# EAGLE design PCB PUMP (EAGLE 9.3.1)
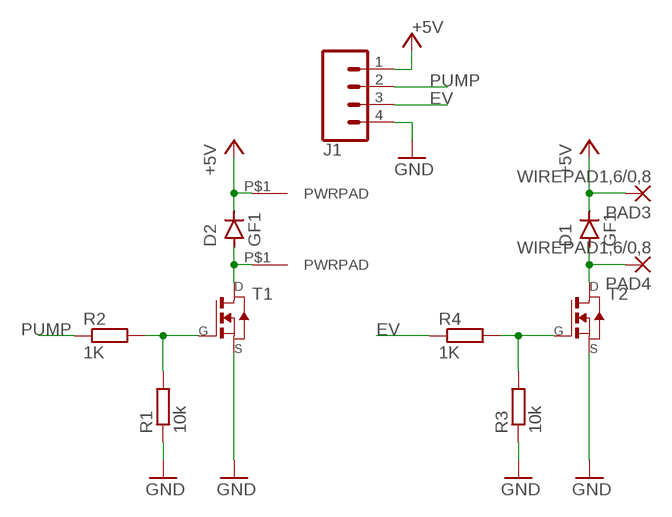
[diagram p0: schematic, sheet 1]

## Parts
D1  GF1  [SMA-DO214AC]
D2  GF1  [SMA-DO214AC]
J1  CONN_04POLAR  [MOLEX-1X4]
J3  PWRPAD2-5MM  [PWRPAD_2-5MM]
J4  PWRPAD2-5MM  [PWRPAD_2-5MM]
PAD3  WIREPAD1,6/0,8  [1,6/0,8]
PAD4  WIREPAD1,6/0,8  [1,6/0,8]
R1  10k  R-EU_R1206  [R1206]
R2  1K  R-EU_R1206  [R1206]
R3  10k  R-EU_R1206  [R1206]
R4  1K  R-EU_R1206  [R1206]
T1  NMOSFETSOT23  [SOT-23]
T2  NMOSFETSOT23  [SOT-23]

## Nets
+5V: D1.K(C) D2.K(C) J1.1 J4.P$1(PWRPAD) PAD3.1(P)
EV: J1.3 R4.1
GND: J1.4 R1.1 R3.1 T1.2(S) T2.2(S)
N$1: D1.A PAD4.1(P) T2.1(D)
N$2: D2.A J3.P$1(PWRPAD) T1.1(D)
N$3: R1.2 R2.2 T1.3(G)
N$4: R3.2 R4.2 T2.3(G)
PUMP: J1.2 R2.1

## Library data of the parts
D1 D2 = diode:GF1: DIODE
J1 = CONNECTORS:CONN_04: Multi connection point. Often used as Generic Header-pin footprint for 0.1 inch spaced/style header connections On any of the 0.1 inch spaced packages, you can populate with these: Break Away Headers - Straight <https://www.sparkfun.com/products/116> (PRT-00116) Break Away Male Headers - Right Angle <https://www.sparkfun.com/products/553> (PRT-00553) Female Headers <https://www.sparkfun.com/products/115> (PRT-00115) Break Away Headers - Machine Pin <https://www.sparkfun.com/products/117> (PRT-00117) Break Away Female Headers - Swiss Machine Pin <https://www.sparkfun.com/products/743> (PRT-00743) For SCREWTERMINALS and SPRING TERMINALS visit here: Screw Terimnals on SparkFun.com <https://www.sparkfun.com/search/results?term=Screw+Terminals> (5mm/3.5mm/2.54mm spacing) This device is also useful as a general connection point to wire up your design to another part of your project. Our various solder wires solder well into these plated through hole pads. Hook-Up Wire - Assortment (Stranded, 22 AWG) <https://www.sparkfun.com/products/11375> (PRT-11375) Hook-Up Wire - Assortment (Solid Core, 22 AWG) <https://www.sparkfun.com/products/11367> (PRT-11367) View the entire wire category on our website here <https://www.sparkfun.com/categories/141> Special notes: Molex polarized connector foot print use with SKU : PRT-08231 with associated crimp pins and housings. 1MM SMD Version SKU: PRT-10208; PROD_ID: CONN-08186; SF_ID: PRT-08231
J3 J4 = fab:PWRPAD
PAD3 PAD4 = wirepad:WIREPAD: Wire PAD connect wire on PCB
R1-R4 = rcl:R-EU_: RESISTOR, European symbol; SPICEPREFIX: R
T1 T2 = fab:NMOSFET: MOS FET

## Board
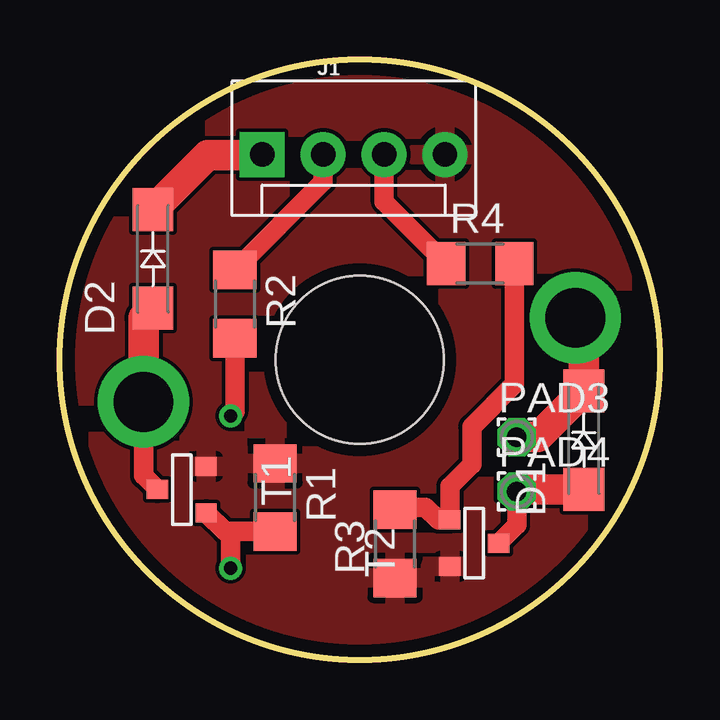
[diagram p1: board, top side]
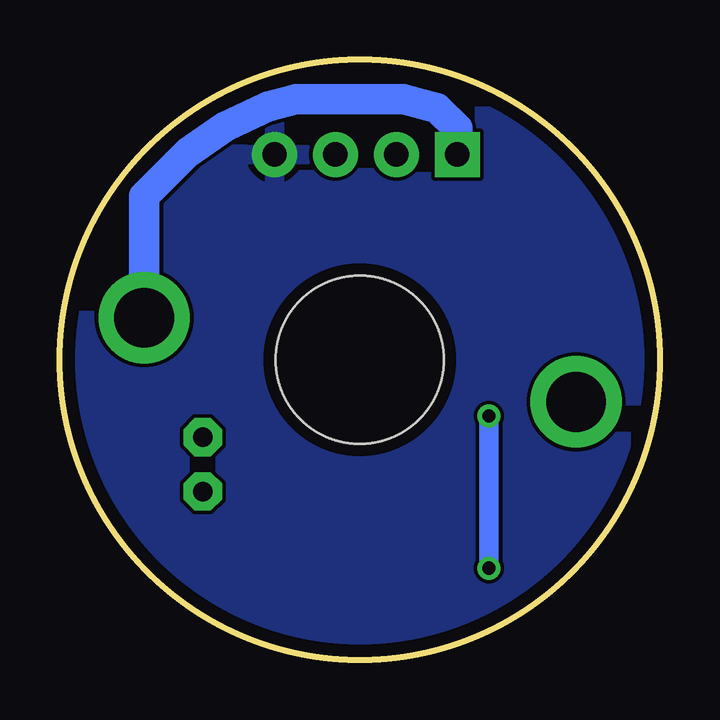
[diagram p2: board, bottom side, seen from below]

Size 25 x 25 mm. Coordinates in mm from the lower left corner, seen from the top.
Outline: circle at 12.5,12.5 radius 12.5
Copper layers (1*16): Top 0.035mm / dielectric 1.5mm / Bottom 0.035mm
Design rules "default *": minimum track width 6mil, minimum drill 0.35mm, track to track 6mil, track to pad 6mil, pad to pad 6mil, via to via 6mil, smd to smd 6mil, copper to edge 20mil, drill to drill 6mil, minimum pad ring 10mil, minimum via ring 8mil, stop-mask expansion 4mil, vias tented up to drill 0mil, thermal gap 10mil
Holes 7 mm at 12.5,12.5

### Footprints (pad centres in the part's own frame; a part is rotated, then mirrored left to right if it is on the bottom)
SMA-DO214AC = smd 1.8 x 1.7: A -2.05,0; K 2.05,0
MOLEX-1X4 = drill 1.016 pad 1.88 square: 1 0,0 | drill 1.016 pad 1.88: 2 2.54,0; 3 5.08,0; 4 7.62,0
PWRPAD_2-5MM = drill 2.489 pad 3.81: P$1 0,0
1,6/0,8 = drill 0.813 pad 1.6 octagon: 1 0,0
R1206 = smd 1.6 x 1.803: 1 -1.422,0; 2 1.422,0
SOT-23 = smd 0.787 x 0.889: 1 0.025,-1.016; 2 -0.94,1.016; 3 0.991,1.016

### Placement (x,y rotation side)
D1  21.84,9.14 90 top
D2  3.88,16.7 90 top
J1  8.43,21.06 0 top
J3  3.48,10.74 0 top
J4  21.49,14.25 0 top
PAD3  19.05,9.27 0 top
PAD4  19.05,7.01 0 top
R1  8.97,6.76 270 top
R2  7.29,14.82 270 top
R3  13.97,4.83 90 top
R4  17.53,16.51 0 top
T1  5.08,7.11 270 top
T2  17.27,4.83 90 top

### Tracks (layer width: path | path; a pad name or v marks a point on that pad's centre or on a via)
+5V
  Top 1.27: J1.1 8.18,21.06 8.16,21.04 6.16,21.04 D2.K | J4.P$1 21.58,14.34 21.74,14.34 21.84,14.24 D1.K 19.92,9.27 PAD3.1
  Bottom 1.27: J1.1 8.43,22.15 9.28,23 10.67,23.37 15.16,23.37 16.34,23.05 18.11,22.23 19.67,21.14 21.49,19.32 J4.P$1
EV
  Top 0.813: R4.1 13.51,19.1 J1.3
GND
  pour Top: -1.02,6.86 -1.02,17.78 7.62,26.42 17.27,26.42 26.16,17.53 26.16,6.86 19.05,-0.25 18.29,-1.02 5.33,-1.02 -1.02,6.6
  pour Bottom: -0.76,7.62 -0.76,18.8 6.1,25.65 18.29,25.65 25.91,18.03 25.91,7.11 18.29,-0.51 7.37,-0.51
N$1
  Top 0.813: T2.1 19.05,5.61 PAD4.1
  Top 1.27: D1.A 19.13,7.09 PAD4.1
N$2
  Top 0.813: T1.1 3.48,7.67 J3.P$1
  Top 1.27: D2.A 3.48,14.26 J3.P$1
N$3  (via drill 0.55)
  Top 0.813: T1.3 6.88,5.33 | 6.88,5.33 R1.2 | R2.2 7.29,10.34 v7.11,10.16 | v7.11,3.81 7.11,5.11 6.88,5.33
  Bottom 0.813: v7.11,10.16 v7.11,3.81
N$4
  Top 0.813: R3.2 14.07,6.35 15.24,6.35 15.77,5.82 T2.3 16.26,7.22 17.17,8.13 17.17,9.7 18.95,11.48 R4.2
PUMP
  Top 0.813: J1.2 10.97,19.92 R2.1